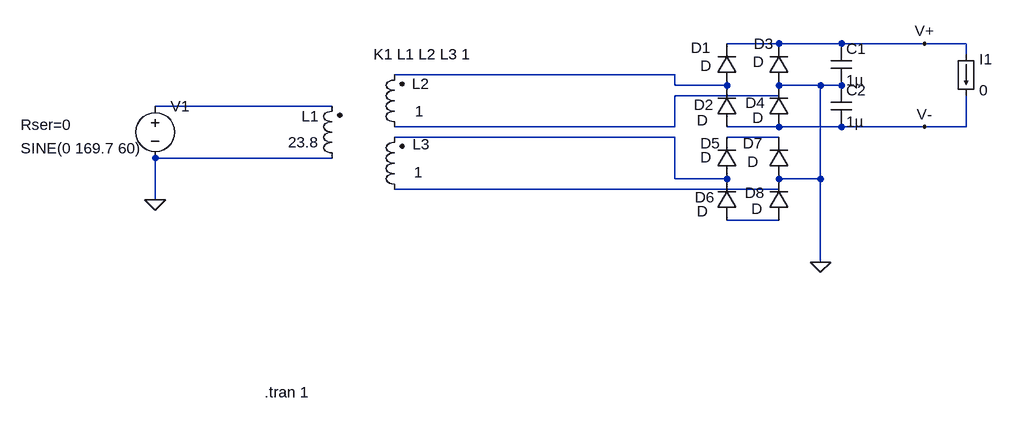
[diagram p0: schematic psu_ideal.asc]
psu_ideal.asc, the LTspice schematic file:
Version 4
SHEET 1 2164 680
WIRE 736 64 656 64
WIRE 832 64 736 64
WIRE 960 64 832 64
WIRE 1024 64 960 64
WIRE 1024 80 1024 64
WIRE 576 112 144 112
WIRE 576 128 576 112
WIRE 656 128 576 128
WIRE 800 128 736 128
WIRE 832 128 800 128
WIRE 736 144 736 128
WIRE 736 144 576 144
WIRE 48 160 -224 160
WIRE 576 192 576 144
WIRE 576 192 144 192
WIRE 736 192 656 192
WIRE 832 192 736 192
WIRE 960 192 832 192
WIRE 1024 192 1024 144
WIRE 1024 192 960 192
WIRE 576 208 144 208
WIRE 736 208 656 208
WIRE 48 240 -224 240
WIRE 576 272 576 208
WIRE 656 272 576 272
WIRE 800 272 800 128
WIRE 800 272 736 272
WIRE 736 288 736 272
WIRE 736 288 144 288
WIRE -224 304 -224 240
WIRE 736 336 656 336
WIRE 800 400 800 272
FLAG -224 304 0
FLAG 800 400 0
FLAG 960 64 V+
FLAG 960 192 V-
SYMBOL ind2 64 256 R180
WINDOW 0 36 80 Left 2
WINDOW 3 36 40 Left 2
SYMATTR InstName L1
SYMATTR Value 23.8
SYMATTR Type ind
SYMATTR SpiceLine Rser=1
SYMBOL ind2 160 208 R180
WINDOW 0 -38 82 Left 2
WINDOW 3 -29 40 Left 2
SYMATTR InstName L2
SYMATTR Value 1
SYMATTR Type ind
SYMATTR SpiceLine Rser=1
SYMBOL voltage -224 144 R0
WINDOW 3 -207 81 Left 2
WINDOW 123 24 180 Left 2
WINDOW 39 -207 45 Left 2
SYMATTR Value SINE(0 169.7 60)
SYMATTR SpiceLine Rser=0
SYMATTR InstName V1
SYMBOL ind2 160 304 R180
WINDOW 0 -39 85 Left 2
WINDOW 3 -28 42 Left 2
SYMATTR InstName L3
SYMATTR Value 1
SYMATTR Type ind
SYMBOL diode 672 128 R180
WINDOW 0 41 58 Left 2
WINDOW 3 40 30 Left 2
SYMATTR InstName D1
SYMBOL diode 672 192 R180
WINDOW 0 36 34 Left 2
WINDOW 3 45 10 Left 2
SYMATTR InstName D2
SYMBOL diode 752 128 R180
WINDOW 0 24 64 Left 2
WINDOW 3 39 36 Left 2
SYMATTR InstName D3
SYMBOL diode 752 192 R180
WINDOW 0 37 37 Left 2
WINDOW 3 40 14 Left 2
SYMATTR InstName D4
SYMBOL diode 672 272 R180
WINDOW 0 26 55 Left 2
WINDOW 3 40 33 Left 2
SYMATTR InstName D5
SYMBOL diode 672 336 R180
WINDOW 0 35 36 Left 2
WINDOW 3 45 14 Left 2
SYMATTR InstName D6
SYMBOL diode 752 272 R180
WINDOW 0 41 55 Left 2
WINDOW 3 47 26 Left 2
SYMATTR InstName D7
SYMBOL diode 752 336 R180
WINDOW 0 38 43 Left 2
WINDOW 3 41 18 Left 2
SYMATTR InstName D8
SYMBOL cap 816 64 R0
SYMATTR InstName C1
SYMATTR Value 1µ
SYMBOL cap 816 128 R0
SYMATTR InstName C2
SYMATTR Value 1µ
SYMBOL load 1008 80 R0
WINDOW 123 0 0 Left 2
WINDOW 39 0 0 Left 2
SYMATTR InstName I1
SYMATTR Value 0
TEXT 112 80 Left 2 !K1 L1 L2 L3 1
TEXT -56 600 Left 2 !.tran 1

The netlist it stands for:
* psu_ideal.asc
L1 0 N002 23.8 Rser=1
L2 0 N001 1 Rser=1
V1 N002 0 SINE(0 169.7 60) Rser=0
L3 0 N003 1
D1 N001 V+ D
D2 V- N001 D
D3 0 V+ D
D4 V- 0 D
D5 N003 N004 D
D6 N005 N003 D
D7 0 N004 D
D8 N005 0 D
C1 V+ 0 1µ
C2 0 V- 1µ
I1 V+ V- 0
.model D D
.lib standard.dio
K1 L1 L2 L3 1
.tran 1
.backanno
.end

* Results of the author's LTspice run, read from the files saved beside the schematic
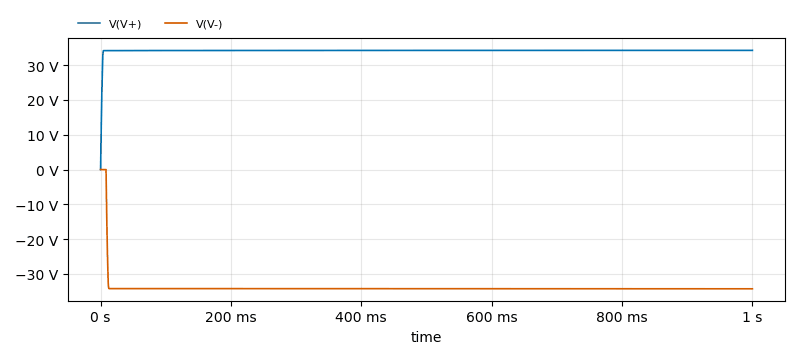
[diagram p1: Transient Analysis of psu_ideal.asc, plotted from the saved traces]
* Transient Analysis, 1 run:
*   V(V+): min 0 V, max 34.27 V, average 34.2 V, rms 34.22 V, last 34.27 V
*   V(V-): min -34.3 V, max 0 V, average -33.94 V, rms 34.1 V, last -34.3 V